# EAGLE schematic MKRNB1500_V3.0 (EAGLE 9.3.0)

## Sheet 1 of 2
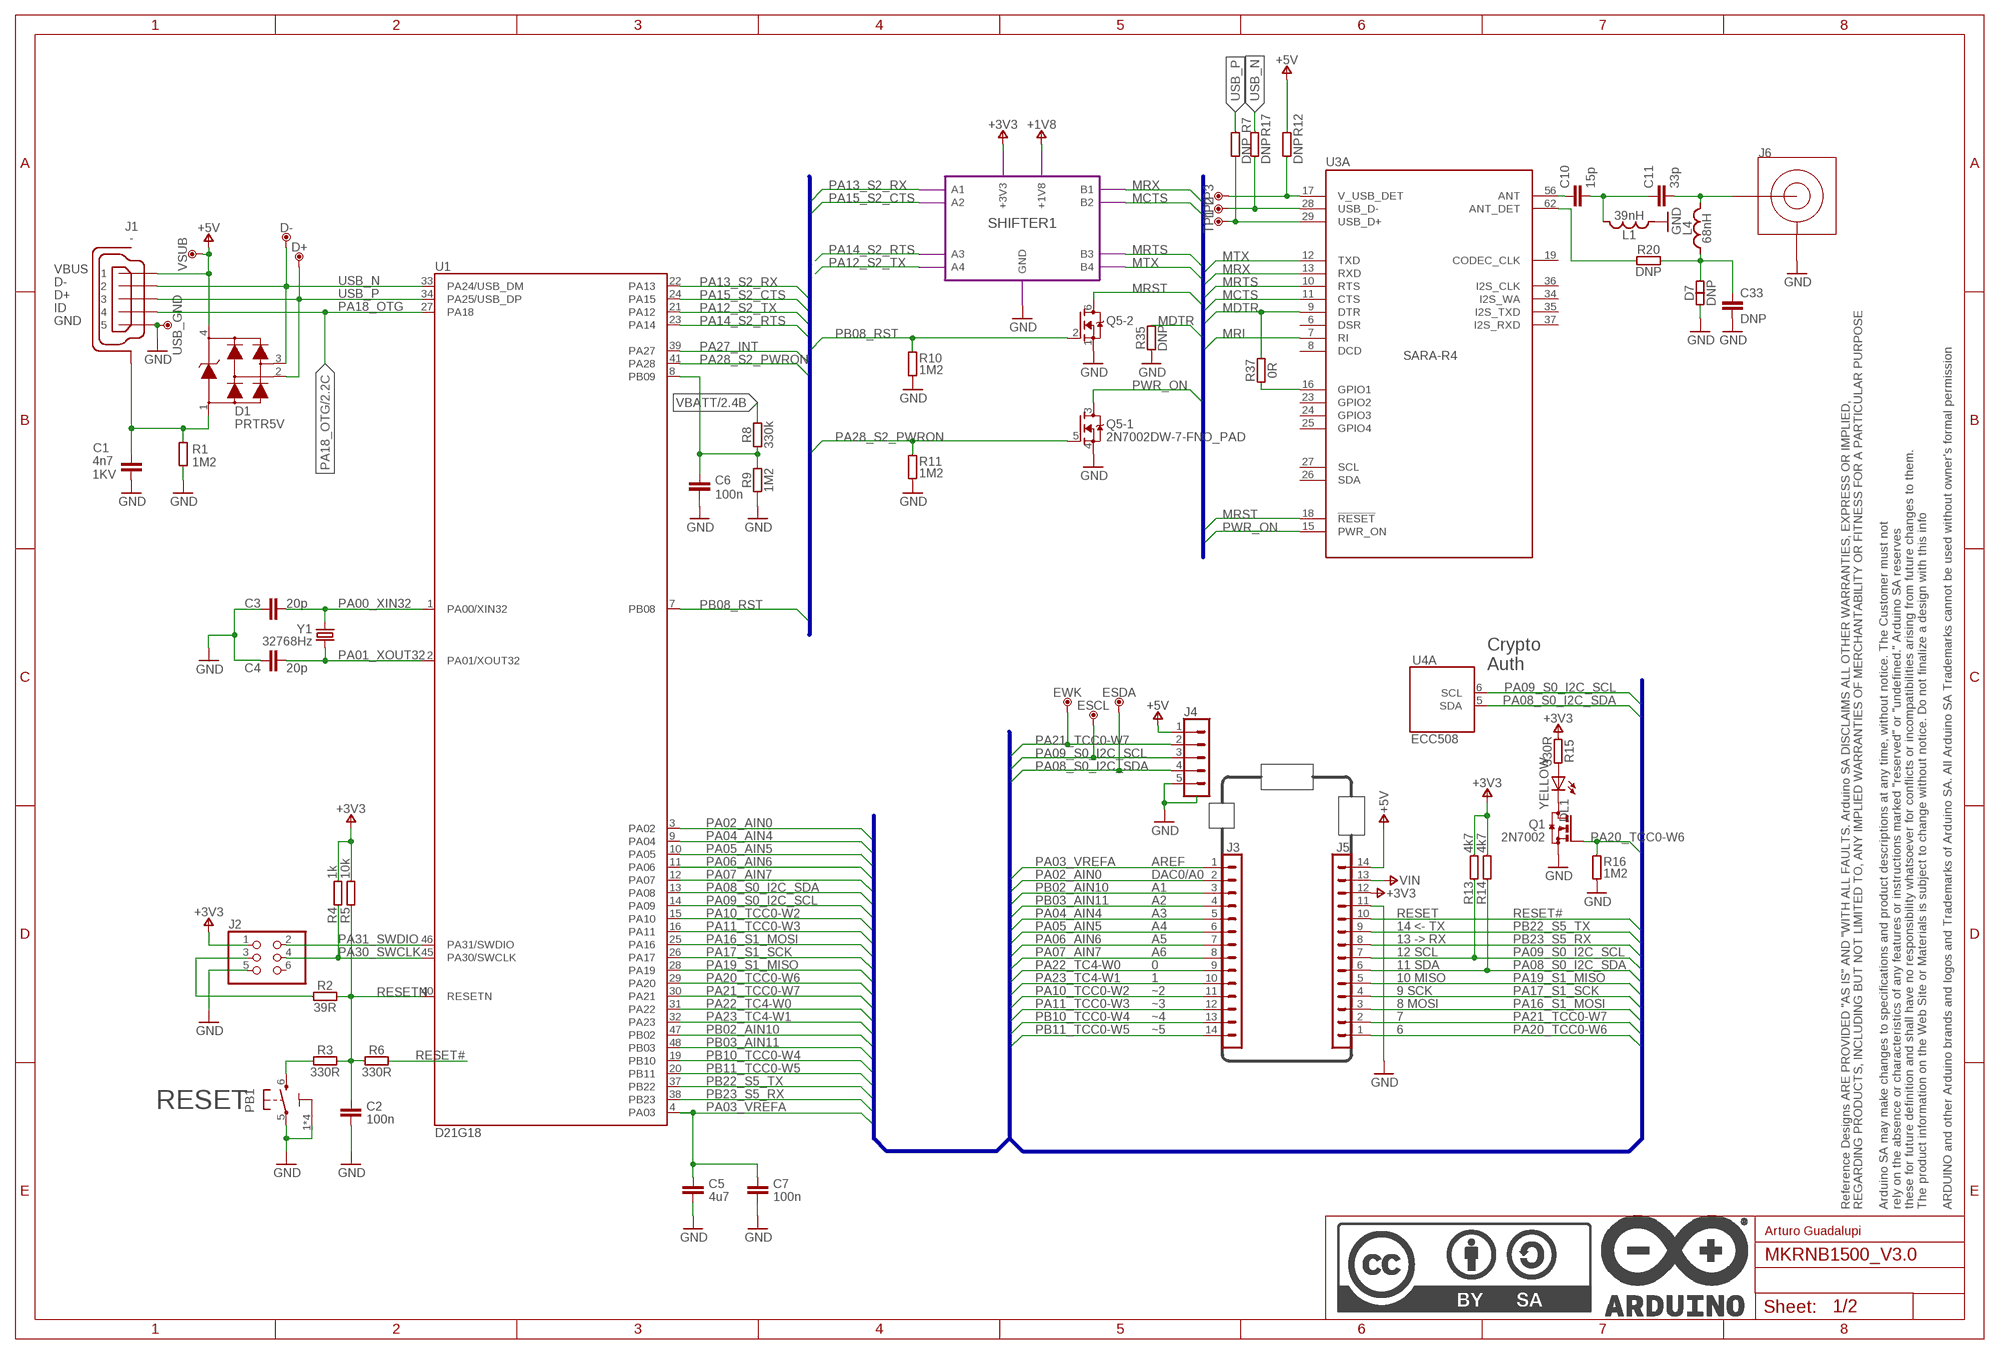
[diagram p0: schematic, sheet 1]

### Parts
C1  4n7  C4.7NF-0805  [0805-R2013X50N]
C2  100n  C-100NF-0402  [0402-1005X55N]
C3  20p  C-20PF-0402  [0402-1005X55N]
C4  20p  C-20PF-0402  [0402-1005X55N]
C5  4u7  C-4.7UF-0402  [0402-1005X55N]
C6  100n  C-100NF-0402  [0402-1005X55N]
C7  100n  C-100NF-0402  [0402-1005X55N]
C10  15p  C-15PF-0402  [0402-1005X55N]
C11  33p  C-33PF-0402  [0402-1005X55N]
C33  DNP  CDNP-0402  [0402-1005X55N]
D1  PRTR5V  PRTR5V0U2X,215  [SOT190P230X110-4N]
D7  DNP  PESD  [0402-1005X55N]
D+  DNP  TPTP-1.00MM  [TP-1.00MM]
D-  DNP  TPTP-1.00MM  [TP-1.00MM]
DL1  YELLOW  LED-YELLOW-0603  [LEDC1608X80N-AK]
ESCL  DNP  TPTP-1.00MM  [TP-1.00MM]
ESDA  DNP  TPTP-1.00MM  [TP-1.00MM]
EWK  DNP  TPTP-1.00MM  [TP-1.00MM]
FRAME1  DNP  A3-FRAME  [FRAME]
J1  -  USB-MICRO  [ZX62-AB-5PA]
J2  DNP  PINHD-2X03-DNPSMD-NH  [2X3_SMT]
J3  -  PINHD-1X14-SM-MALE/FEMALETH-SMD  [1X14_SMD_TH]
J4  -  SM05B-SRSS-TB  [SM05B-SRSS-TB]
J5  -  PINHD-1X14-SM-MALE/FEMALETH-SMD  [1X14_SMD_TH]
J6  -  UFL  [U.FL-R-SMT-1(60)]
L1  39nH  L-39NH-0402  [C0402]
L4  68nH  L-68NH-0402  [C0402]
PB1  PTS820  TACTILE1PTS820-NH  [C&K_PTS820_NO_HOLES]
Q1  2N7002  2N7002T-SOT523  [SOTFL50P160X78-3]
Q5  2N7002DW-7-FNO_PAD  [PWR_SC70-6L2]
R1  1M2  R-1M2-0402  [0402-1005X55N]
R2  39R  R-39R-0402  [0402-1005X55N]
R3  330R  R-330R-0402  [0402-1005X55N]
R4  1k  R-1K-0402  [0402-1005X55N]
R5  10k  R-10K-0402  [0402-1005X55N]
R6  330R  R-330R-0402  [0402-1005X55N]
R7  DNP  R-DNP-0402  [0402-1005X55N]
R8  330k  R-330K-0402  [0402-1005X55N]
R9  1M2  R-1M2-0402  [0402-1005X55N]
R10  1M2  R-1M2-0402  [0402-1005X55N]
R11  1M2  R-1M2-0402  [0402-1005X55N]
R12  DNP  R-DNP-0402  [0402-1005X55N]
R13  4k7  R-4K7-0402  [0402-1005X55N]
R14  4k7  R-4K7-0402  [0402-1005X55N]
R15  330R  R-330R-0402  [0402-1005X55N]
R16  1M2  R-1M2-0402  [0402-1005X55N]
R17  DNP  R-DNP-0402  [0402-1005X55N]
R20  DNP  R-DNP-0402  [0402-1005X55N]
R35  DNP  R-DNP-0402  [0402-1005X55N]
R37  0R  R-0R-0402  [0402-1005X55N]
TP1  DNP  TPTP-1.00MM  [TP-1.00MM]
TP2  DNP  TPTP-1.00MM  [TP-1.00MM]
TP3  DNP  TPTP-1.00MM  [TP-1.00MM]
U1  D21G18  ATSAMD21G18A-48QFN  [QFN50P700X700X90-49XN-EPSQ515]
U3  SARA-R4  [SARA-96]
U4  ECC508  ATECC-5088-UDFN  [SON50P300X200X60-9N-EP160X140]
USB_GND  DNP  TPTP-1.00MM  [TP-1.00MM]
VSUB  DNP  TPTP-1.00MM  [TP-1.00MM]
Y1  32768Hz  32.768KHZ  [ABS07]

### Module instances
SHIFTER1 = SHIFTER (part numbers offset by 100)

### Nets
+1V8: port SHIFTER1.+1V8 ; also sheet 2
+3V3: J2.1 J5.12 R4.2 R5.2 R13.2 R14.2 R15.1 ; port SHIFTER1.+3V3 ; also sheet 2
+5V: D1.4 J1.1 J4.1 J5.14 R12.1 VSUB.X ; also sheet 2
GND: C1.2 C2.2 C3.1 C4.1 C5.2 C6.2 C7.2 C33.2 D7.1 J1.5 J2.5 J4.5 J4.SH1(SH) J4.SH2(SH) J5.11 J6.GND1(GND) J6.GND2(GND) L1.1 PB1.1 PB1.2 PB1.3 PB1.4 PB1.5 Q1.S Q5.1(-2:S) Q5.4(-1:S) R1.1 R9.1 R10.1 R11.1 R16.1 R35.1 USB_GND.X ; port SHIFTER1.GND ; also sheet 2
MCTS: U3.11(A:CTS) ; port SHIFTER1.B2
MDTR: R35.2 R37.2 U3.9(A:DTR)
MRI: U3.7(A:RI)
MRST: Q5.6(-2:D) U3.18(A:!RESET)
MRTS: U3.10(A:RTS) ; port SHIFTER1.B3
MRX: U3.13(A:RXD) ; port SHIFTER1.B1
MTX: U3.12(A:TXD) ; port SHIFTER1.B4
N17658775: PB1.6 R3.1
N$1: C1.1 D1.1 J1.6(SH) J1.7(SH) J1.8(SH) J1.9(SH) J1.10(SH) J1.11(SH) R1.2
N$4: J2.3 R2.1
N$5: C10.1 U3.56(A:ANT)
N$6: C6.1 R8.1 R9.2 U1.8(PB09)
N$7: DL1.A R15.2
N$8: C11.2 J6.SIG L4.2
N$9: R7.2 TP1.X U3.29(A:USB_D+)
N$10: DL1.C Q1.D
N$12: R17.2 TP2.X U3.28(A:USB_D-)
N$13: R12.2 TP3.X U3.17(A:V_USB_DET)
N$14: C10.2 C11.1 L1.2
N$20: R37.1 U3.16(A:GPIO1)
N$25: R20.1 U3.62(A:ANT_DET)
N$26: C33.1 D7.2 L4.1 R20.2
PA00_XIN32: C3.2 U1.1(PA00/XIN32) Y1.2
PA01_XOUT32: C4.2 U1.2(PA01/XOUT32) Y1.1
PA02_AIN0: J3.2 U1.3(PA02)
PA03_VREFA: C5.1 C7.1 J3.1 U1.4(PA03)
PA04_AIN4: J3.5 U1.9(PA04)
PA05_AIN5: J3.6 U1.10(PA05)
PA06_AIN6: J3.7 U1.11(PA06)
PA07_AIN7: J3.8 U1.12(PA07)
PA08_S0_I2C_SDA: ESDA.X J4.4 J5.6 R14.1 U1.13(PA08) U4.5(A:SDA) ; also sheet 2
PA09_S0_I2C_SCL: ESCL.X J4.3 J5.7 R13.1 U1.14(PA09) U4.6(A:SCL) ; also sheet 2
PA10_TCC0-W2: J3.11 U1.15(PA10)
PA11_TCC0-W3: J3.12 U1.16(PA11)
PA12_S2_TX: U1.21(PA12) ; port SHIFTER1.A4
PA13_S2_RX: U1.22(PA13) ; port SHIFTER1.A1
PA14_S2_RTS: U1.23(PA14) ; port SHIFTER1.A3
PA15_S2_CTS: U1.24(PA15) ; port SHIFTER1.A2
PA16_S1_MOSI: J5.3 U1.25(PA16)
PA17_S1_SCK: J5.4 U1.26(PA17)
PA18_OTG: J1.4 U1.27(PA18) ; also sheet 2
PA19_S1_MISO: J5.5 U1.28(PA19)
PA20_TCC0-W6: J5.1 Q1.G R16.2 U1.29(PA20)
PA21_TCC0-W7: EWK.X J4.2 J5.2 U1.30(PA21)
PA22_TC4-W0: J3.9 U1.31(PA22)
PA23_TC4-W1: J3.10 U1.32(PA23)
PA27_INT: U1.39(PA27) ; also sheet 2
PA28_S2_PWRON: Q5.5(-1:G) R11.2 U1.41(PA28)
PA30_SWCLK: J2.4 R4.1 U1.45(PA30/SWCLK)
PA31_SWDIO: J2.2 U1.46(PA31/SWDIO)
PB02_AIN10: J3.3 U1.47(PB02)
PB03_AIN11: J3.4 U1.48(PB03)
PB08_RST: Q5.2(-2:G) R10.2 U1.7(PB08)
PB10_TCC0-W4: J3.13 U1.19(PB10)
PB11_TCC0-W5: J3.14 U1.20(PB11)
PB22_S5_TX: J5.9 U1.37(PB22)
PB23_S5_RX: J5.8 U1.38(PB23)
PWR_ON: Q5.3(-1:D) U3.15(A:PWR_ON)
RESET#: J5.10 R6.2
RESETN: C2.1 R2.2 R3.2 R5.1 R6.1 U1.40(RESETN)
USB_N [usb]: D1.3 D-.X J1.2 R17.1 U1.33(PA24/USB_DM)
USB_P [usb]: D1.2 D+.X J1.3 R7.1 U1.34(PA25/USB_DP)
VBATT: R8.2 ; also sheet 2
VIN: J5.13 ; also sheet 2
Unconnected: J2.6 U3.6(A:DSR) U3.8(A:DCD) U3.19(A:CODEC_CLK) U3.23(A:GPIO2) U3.24(A:GPIO3) U3.25(A:GPIO4) U3.26(A:SDA) U3.27(A:SCL) U3.34(A:I2S_WA) U3.35(A:I2S_TXD) U3.36(A:I2S_CLK) U3.37(A:I2S_RXD)

### Buses
PA03_VREFA,PA02_AIN0,PB02_AIN10,PB03_AIN11,PA04_AIN4,PA05_AIN5,PA06_AIN6,PA07_AIN7,PA22_TC4-W0,PA23_TC4-W1,PA10_TCC0-W2,PA11_TCC0-W3,PB10_TCC0-W4,PB11_TCC0-W5,PA20_TCC0-W6,PA21_TCC0-W7,PA16_S1_MOSI,PA17_S1_SCK,PA19_S1_MISO,PA08_S0_I2C_SDA,PA09_S0_I2C_SCL,PB23_S5_RX,PB22_S5_TX,RESET#
MDTR,MI2SCLK,MRI
PA27_INT

### Notes on the sheet
- Crypto
  Auth
- AREF
- DAC0/A0
- A1
- A2
- A3 | RESET
- A4 | 14 <- TX
- A5 | 13 -> RX
- A6 | 12 SCL
- 0 | 11 SDA
- 1 | 10 MISO
- ~2 | 9 SCK
- ~3 | 8 MOSI
- ~4 | 7
- ~5 | 6
- RESET
- Arturo Guadalupi

## Sheet 2 of 2
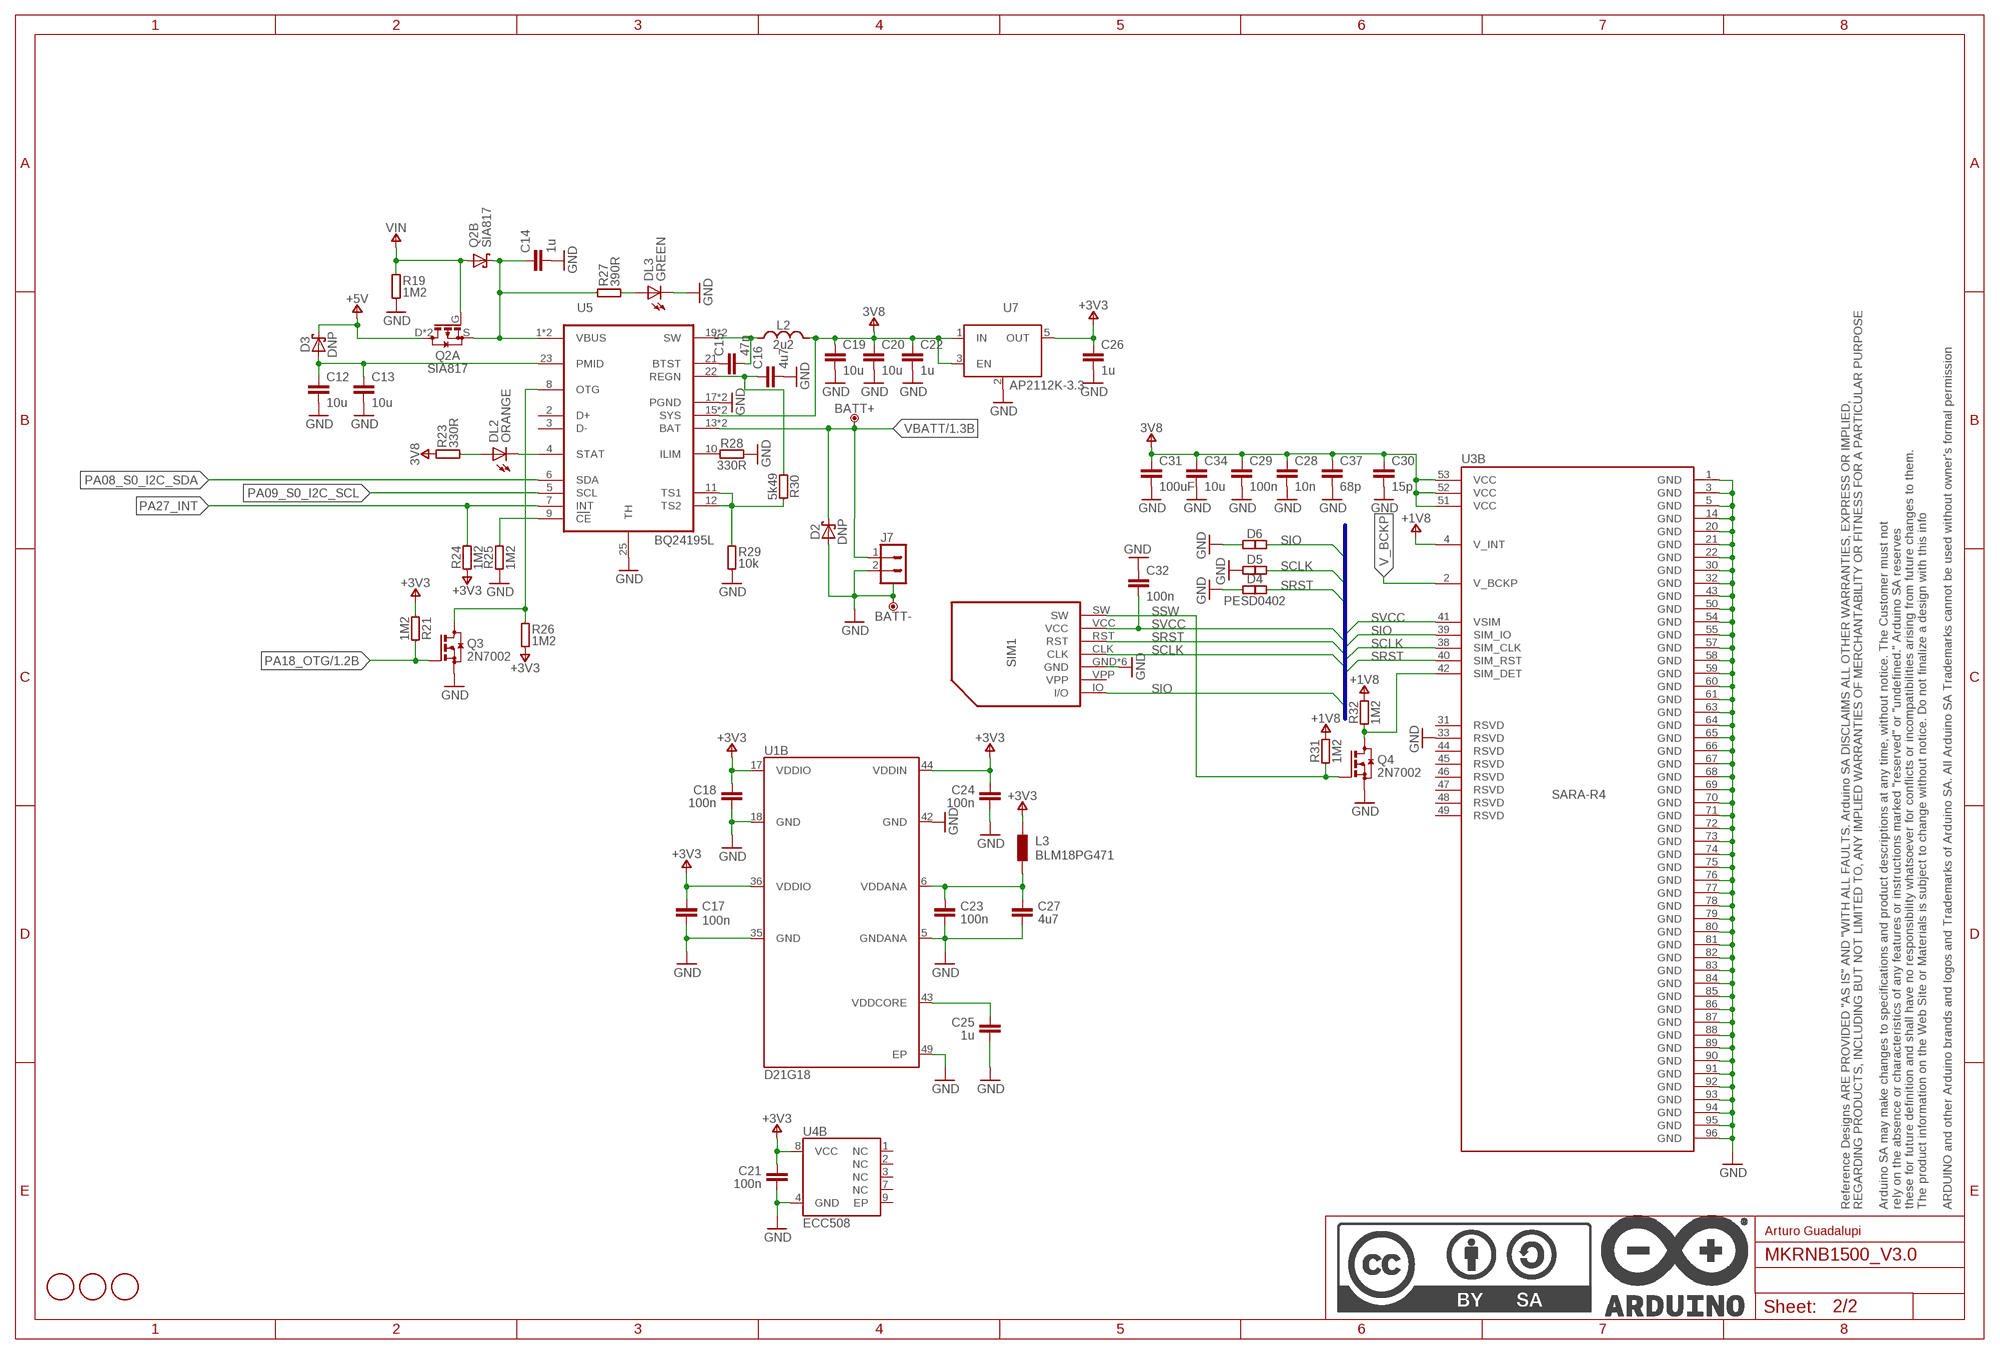
[diagram p1: schematic, sheet 2]

### Parts
BATT+  DNP  TPTP-1.00MM  [TP-1.00MM]
BATT-  DNP  TPTP-1.00MM  [TP-1.00MM]
C12  10u  C-10UF-0603  [0603-1608X90N]
C13  10u  C-10UF-0603  [0603-1608X90N]
C14  1u  C-1UF-0402  [0402-1005X55N]
C15  47n  C-47N-0402  [0402-1005X55N]
C16  4u7  C-4.7UF-0402  [0402-1005X55N]
C17  100n  C-100NF-0402  [0402-1005X55N]
C18  100n  C-100NF-0402  [0402-1005X55N]
C19  10u  C-10UF-0603  [0603-1608X90N]
C20  10u  C-10UF-0603  [0603-1608X90N]
C21  100n  C-100NF-0402  [0402-1005X55N]
C22  1u  C-1UF-0402  [0402-1005X55N]
C23  100n  C-100NF-0402  [0402-1005X55N]
C24  100n  C-100NF-0402  [0402-1005X55N]
C25  1u  C-1UF-0402  [0402-1005X55N]
C26  1u  C-1UF-0402  [0402-1005X55N]
C27  4u7  C-4.7UF-0603  [0603-1608X90N]
C28  10n  C-10NF-0402  [0402-1005X55N]
C29  100n  C-100NF-0402  [0402-1005X55N]
C30  15p  C-15PF-0402  [0402-1005X55N]
C31  100uF  C-100UF-1206  [C1206]
C32  100n  C-100NF-0402  [0402-1005X55N]
C34  10u  C-10UF-0603  [0603-1608X90N]
C37  68p  C-68PF-0402  [0402-1005X55N]
D2  DNP  PMEG6020AELRX-DNP  [SODFL3517X110N]
D3  DNP  PMEG6020AELRX-DNP  [SODFL3517X110N]
D4  PESD0402  PESD  [0402-1005X55N]
D5  PESD0402  PESD  [0402-1005X55N]
D6  PESD0402  PESD  [0402-1005X55N]
DL2  ORANGE  LED-ORANGE-0603  [LEDC1608X80N-AK]
DL3  GREEN  LED-GREEN-0603  [LEDC1608X80N-AK]
FD1  DNP  FIDUCIAL-1.5MM  [FD-1-1.5]
FD2  DNP  FIDUCIAL-1.5MM  [FD-1-1.5]
FD3  DNP  FIDUCIAL-1.5MM  [FD-1-1.5]
FRAME2  DNP  A3-FRAME  [FRAME]
J7  -  BATTERY  [JST-S2B-PH-SM4-TB]
L2  2u2  LSRP  [SRP4020]
L3  BLM18PG471  FERRITE-470R0603  [0603-1608X90N]
Q2  SIA817  SIA817EDJ  [SON65P205X205X75-8N-MWSD]
Q3  2N7002  2N7002T-SOT523  [SOTFL50P160X78-3]
Q4  2N7002  2N7002T-SOT523  [SOTFL50P160X78-3]
R19  1M2  R-1M2-0402  [0402-1005X55N]
R21  1M2  R-1M2-0402  [0402-1005X55N]
R23  330R  R-330R-0402  [0402-1005X55N]
R24  1M2  R-1M2-0402  [0402-1005X55N]
R25  1M2  R-1M2-0402  [0402-1005X55N]
R26  1M2  R-1M2-0402  [0402-1005X55N]
R27  390R  R-390R-0402  [0402-1005X55N]
R28  330R  R-330R-0402  [0402-1005X55N]
R29  10k  R-10K-0402  [0402-1005X55N]
R30  5k49  R-5K49-0402  [0402-1005X55N]
R31  1M2  R-1M2-0402  [0402-1005X55N]
R32  1M2  R-1M2-0402  [0402-1005X55N]
SIM1  -  SIM  [MICROSIM8]
U5  BQ24195L  BQ24195QFN-24  [QFN24]
U7  AP2112K-3.3  [SOT25]

### Nets
+1V8: R31.2 R32.2 U3.4(B:V_INT) ; also sheet 1
+3V3: C17.1 C18.1 C21.1 C24.1 C26.1 L3.1 R21.1 R24.1 R26.1 U1.17(VDDIO) U1.36(VDDIO) U1.44(VDDIN) U4.8(B:VCC) U7.5(OUT) ; also sheet 1
+3V8: C19.1 C20.1 C22.1 C28.1 C29.1 C30.1 C31.1 C34.1 C37.1 L2.2 R23.2 U3.51(B:VCC) U3.52(B:VCC) U3.53(B:VCC) U5.15(SYS) U5.16(SYS) U7.1(IN) U7.3(EN) ; supply symbol labelled 3V8
+5V: D3.C Q2.D2(A:D) Q2.D(A:D) ; also sheet 1
GND: BATT-.X C12.2 C13.2 C14.2 C16.2 C17.2 C18.2 C19.2 C20.2 C21.2 C22.2 C23.2 C24.2 C25.2 C26.2 C27.2 C28.2 C29.2 C30.2 C31.2 C32.1 C34.2 C37.2 D2.A D4.1 D5.1 D6.1 DL3.C J7.2 J7.3(SH) J7.4(SH) Q3.S Q4.S R19.1 R25.1 R28.2 R29.1 SIM1.GND SIM1.SH1(GND) SIM1.SH2(GND) SIM1.SH3(GND) SIM1.SH4(GND) SIM1.SH5(GND) U1.5(GNDANA) U1.18(GND) U1.35(GND) U1.42(GND) U1.49(EP) U3.1(B:GND) U3.3(B:GND) U3.5(B:GND) U3.14(B:GND) U3.20(B:GND) U3.21(B:GND) U3.22(B:GND) U3.30(B:GND) U3.32(B:GND) U3.33(B:RSVD) U3.43(B:GND) U3.50(B:GND) U3.54(B:GND) U3.55(B:GND) U3.57(B:GND) U3.58(B:GND) U3.59(B:GND) U3.60(B:GND) U3.61(B:GND) U3.63(B:GND) U3.64(B:GND) U3.65(B:GND) U3.66(B:GND) U3.67(B:GND) U3.68(B:GND) U3.69(B:GND) U3.70(B:GND) U3.71(B:GND) U3.72(B:GND) U3.73(B:GND) U3.74(B:GND) U3.75(B:GND) U3.76(B:GND) U3.77(B:GND) U3.78(B:GND) U3.79(B:GND) U3.80(B:GND) U3.81(B:GND) U3.82(B:GND) U3.83(B:GND) U3.84(B:GND) U3.85(B:GND) U3.86(B:GND) U3.87(B:GND) U3.88(B:GND) U3.89(B:GND) U3.90(B:GND) U3.91(B:GND) U3.92(B:GND) U3.93(B:GND) U3.94(B:GND) U3.95(B:GND) U3.96(B:GND) U4.4(B:GND) U5.17(PGND) U5.18(PGND) U5.25(TH) U7.2(GND/ADJ) ; also sheet 1
N17798864: DL2.A R23.1
N17834267: DL3.A R27.1
N17852357: C23.1 C27.1 L3.2 U1.6(VDDANA)
N17852431: C25.1 U1.43(VDDCORE)
N$11: Q4.D R32.1 U3.42(B:SIM_DET)
N$15: C15.2 L2.1 U5.19(SW) U5.20(SW)
N$17: C14.1 Q2.K2(B:C) Q2.K(B:C) Q2.S(A:S) R27.2 U5.1(VBUS) U5.24(VBUS)
N$18: C15.1 U5.21(BTST)
N$19: R28.1 U5.10(ILIM)
N$21: C16.1 R30.1 U5.22(REGN)
N$22: Q3.D R26.2 U5.8(OTG)
N$23: R29.2 R30.2 U5.11(TS1) U5.12(TS2)
N$24: R25.2 U5.9(CE)
PA08_S0_I2C_SDA: U5.6(SDA) ; also sheet 1
PA09_S0_I2C_SCL: U5.5(SCL) ; also sheet 1
PA18_OTG: Q3.G R21.2 ; also sheet 1
PA27_INT: R24.2 U5.7(INT) ; also sheet 1
SCLK: D5.2 SIM1.CLK U3.38(B:SIM_CLK)
SIO: D6.2 SIM1.IO(I/O) U3.39(B:SIM_IO)
SRST: D4.2 SIM1.RST U3.40(B:SIM_RST)
SSW: Q4.G R31.1 SIM1.SW
STAT: DL2.C U5.4(STAT)
SVCC: C32.2 SIM1.VCC U3.41(B:VSIM)
V_BCKP: U3.2(B:V_BCKP)
VBATT: BATT+.X D2.C J7.1 U5.13(BAT) U5.14(BAT) ; also sheet 1
VIN: Q2.A(B:A) Q2.G(A:G) R19.2 ; also sheet 1
VUSB1: C12.1 C13.1 D3.A U5.23(PMID)
Unconnected: SIM1.VPP U3.31(B:RSVD) U3.44(B:RSVD) U3.45(B:RSVD) U3.46(B:RSVD) U3.47(B:RSVD) U3.48(B:RSVD) U3.49(B:RSVD) U4.1(B:NC) U4.2(B:NC) U4.3(B:NC) U4.7(B:NC) U4.9(B:EP) U5.2(D+) U5.3(D-)

### Buses
B$1

### Notes on the sheet
- Arturo Guadalupi

## Library data of the parts
BATT+ BATT- D+ D- ESCL ESDA EWK TP1-TP3 USB_GND VSUB = Arduino-utility:TP: Testpoint; CODE-ARDUINO: DNP; DATASHEET: DNP; DISTRIBUTOR-LINK: DNP; DISTRIBUTOR-PN: DNP; MANUFACTURER: DNP; MANUFACTURER-PN: DNP
C1 = Arduino-rcl:C: SMD Capacitor; CODE-ARDUINO: 0689; DATASHEET: http://www.kemet.com/Lists/ProductCatalog/Attachments/40/KEM_C1010_X7R_HV_SMD.pdf; DISTRIBUTOR-LINK: www.kemet.com/docfinder?Partnumber=C0805C472KDRACTU; DISTRIBUTOR-PN: 399-6738-1-ND; MANUFACTURER: Kemet; MANUFACTURER-PN: C0805C472KDRACTU; NOTE: -; VOLTAGE: 1KV
C2 C6 C7 C17 C18 C21 C23 C24 C29 C32 = Arduino-rcl:C: SMD Capacitor; CODE-ARDUINO: 0132; DATASHEET: http://www.tdk.com/pdf/TDKMLCCCapRange.pdf; DISTRIBUTOR-LINK: http://www.digikey.com/product-detail/en/tdk-corporation/C1005X5R1H104K050BB/445-5942-1-ND/2443982; DISTRIBUTOR-PN: 445-5942-1-ND; MANUFACTURER: TDK; MANUFACTURER-PN: C1005X5R1H104K050BB; NOTE: -
C3 C4 = Arduino-rcl:C: SMD Capacitor; CODE-ARDUINO: 2188; DATASHEET: http://www.kemet.com/docfinder?Partnumber=CBR04C200J5GAC; DISTRIBUTOR-LINK: http://www.digikey.com/product-detail/en/kemet/CBR04C200J5GAC/399-6173-1-ND/2732143; DISTRIBUTOR-PN: 399-6173-1-ND; MANUFACTURER: Kemet; MANUFACTURER-PN: CBR04C200J5GAC; NOTE: -
C5 C16 = Arduino-rcl:C: SMD Capacitor; CODE-ARDUINO: 0833; DATASHEET: http://search.murata.co.jp/Ceramy/image/img/A01X/partnumbering_e_01.pdf; DISTRIBUTOR-LINK: http://www.digikey.com/product-detail/en/murata-electronics-north-america/GRM155R60J475ME47D/490-5915-1-ND/3719860; DISTRIBUTOR-PN: 490-5915-1-ND; MANUFACTURER: Murata; MANUFACTURER-PN: GRM155R60J475ME47D; NOTE: -
C10 C30 = Arduino-rcl:C: SMD Capacitor; CODE-ARDUINO: -; DATASHEET: http://search.murata.co.jp/Ceramy/image/img/A01X/partnumbering_e_01.pdf; DISTRIBUTOR-LINK: https://www.digikey.com/product-detail/en/murata-electronics-north-america/GRM1555C1H150JA01D/490-5888-1-ND/3315234; DISTRIBUTOR-PN: 490-5888-1-ND; MANUFACTURER: Murata; MANUFACTURER-PN: GRM1555C1H150JA01D; NOTE: -
C11 = Arduino-rcl:C: SMD Capacitor; CODE-ARDUINO: -; DATASHEET: http://www.murata.com/~/media/webrenewal/support/library/catalog/products/capacitor/mlcc/c02e.pdf; DISTRIBUTOR-LINK: http://www.digikey.com/product-search/en?keywords=490-5936-1-ND; DISTRIBUTOR-PN: 490-5936-1-ND; MANUFACTURER: Murata; MANUFACTURER-PN: GRM1555C1H330JA01D; NOTE: -
C12 C13 C19 C20 C34 = Arduino-rcl:C: SMD Capacitor; CODE-ARDUINO: 2213; DATASHEET: http://www.murata.com/~/media/webrenewal/support/library/catalog/products/capacitor/mlcc/c02e.pdf; DISTRIBUTOR-LINK: http://www.digikey.com/product-search/en?keywords=490-10728-1-ND; DISTRIBUTOR-PN: 490-10728-1-ND; MANUFACTURER: Murata; MANUFACTURER-PN: GRM188R61C106KAALD; NOTE: -
C14 C22 C25 C26 = Arduino-rcl:C: SMD Capacitor; CODE-ARDUINO: 0133; DATASHEET: http://search.murata.co.jp/Ceramy/image/img/A01X/partnumbering_e_01.pdf; DISTRIBUTOR-LINK: http://www.digikey.com/product-detail/en/murata-electronics-north-america/GRM155R61E105KA12D/490-10017-1-ND/5026367; DISTRIBUTOR-PN: 490-10017-1-ND; MANUFACTURER: Murata; MANUFACTURER-PN: GRM155R61E105KA12D; NOTE: -
C15 = Arduino-rcl:C: SMD Capacitor; CODE-ARDUINO: 2216; DATASHEET: http://www.murata.com/~/media/webrenewal/support/library/catalog/products/capacitor/mlcc/c02e.pdf; DISTRIBUTOR-LINK: https://www.digikey.com/product-detail/en/murata-electronics-north-america/GRM155R71E473KA88D/490-3254-1-ND/702795; DISTRIBUTOR-PN: 490-3254-1-ND; MANUFACTURER: Murata; MANUFACTURER-PN: GRM155R71E473KA88D; NOTE: -
C27 = Arduino-rcl:C: SMD Capacitor; CODE-ARDUINO: 0458; DATASHEET: http://www.murata.com/~/media/webrenewal/support/library/catalog/products/capacitor/mlcc/c02e.pdf; DISTRIBUTOR-LINK: http://www.digikey.com/product-search/en?keywords=490-7203-1-ND; DISTRIBUTOR-PN: 490-7203-1-ND; MANUFACTURER: Murata; MANUFACTURER-PN: GRM188R61E475KE11D; NOTE: -
C28 = Arduino-rcl:C: SMD Capacitor; CODE-ARDUINO: 0165; DATASHEET: http://search.murata.co.jp/Ceramy/image/img/A01X/partnumbering_e_01.pdf; DISTRIBUTOR-LINK: http://www.digikey.com/product-detail/en/murata-electronics-north-america/GRM155R71H103KA88J/490-6351-1-ND/3845548; DISTRIBUTOR-PN: 490-6351-1-ND; MANUFACTURER: Murata; MANUFACTURER-PN: GRM155R71H103KA88J; NOTE: -
C31 = Arduino-rcl:C: SMD Capacitor; CODE-ARDUINO: -; DATASHEET: http://search.murata.co.jp/Ceramy/image/img/A01X/partnumbering_e_01.pdf; DISTRIBUTOR-LINK: https://www.digikey.com/product-detail/en/murata-electronics-north-america/GRM31CD80J107ME39L/490-10525-1-ND/5026461; DISTRIBUTOR-PN: 490-10525-1-ND; MANUFACTURER: Murata; MANUFACTURER-PN: GRM31CD80J107ME39L; NOTE: -
C33 = Arduino-rcl:C: SMD Capacitor; CODE-ARDUINO: DNP; DATASHEET: DNP; DISTRIBUTOR-LINK: DNP; DISTRIBUTOR-PN: DNP; MANUFACTURER: DNP; MANUFACTURER-PN: DNP; NOTE: DNP
C37 = Arduino-rcl:C: SMD Capacitor; CODE-ARDUINO: -; DATASHEET: http://search.murata.co.jp/Ceramy/image/img/A01X/partnumbering_e_01.pdf; DISTRIBUTOR-LINK: https://www.digikey.com/product-detail/en/murata-electronics-north-america/GRM1555C2A680JA01D/490-7309-1-ND/4213238; DISTRIBUTOR-PN: 490-7309-1-ND; MANUFACTURER: Murata; MANUFACTURER-PN: GRM1555C2A680JA01D; NOTE: -
D1 = Arduino-diodes:PRTR5V0U2X,215: USB ESD protection; CODE-ARDUINO: 2209; DATASHEET: http://www.nxp.com/documents/data_sheet/PRTR5V0U2X.pdf; DISTRIBUTOR-LINK: http://www.digikey.com/product-detail/en/nxp-semiconductors/PRTR5V0U2X,215/568-4140-1-ND/1589981; DISTRIBUTOR-PN: 568-4140-1-ND; MANUFACTURER: NXP; MANUFACTURER-PN: PRTR5V0U2X,215
D2 D3 = Arduino-diodes:PMEG6020AELRX: 60 V, 2 A low leakage current Schottky barrier rectifier Datasheet <http://www.nxp.com/documents/data_sheet/PMEG6020AELR.pdf>; CODE-ARDUINO: DNP; DATASHEET: DNP; DISTRIBUTOR-LINK: DNP; DISTRIBUTOR-PN: DNP; MANUFACTURER: DNP; MANUFACTURER-PN: DNP
D4-D6 = Arduino-diodes:PESD: ESD protection; CODE-ARDUINO: 2280; DATASHEET: http://www.littelfuse.com/~/media/electronics/product_specifications/polymer_esd_suppressors/littelfuse_polymer_esd_suppressor_pesd0402_140_product_specification.pdf.pdf; DISTRIBUTOR-LINK: https://www.digikey.com/product-detail/en/littelfuse-inc/PESD0402-140/PESD0402-140CT-ND/1968526; DISTRIBUTOR-PN: PESD0402-140CT-ND; MANUFACTURER: Littlefuse; MANUFACTURER-PN: PESD0402-140
D7 = Arduino-diodes:PESD: ESD protection; CODE-ARDUINO: 2280; DATASHEET: http://www.littelfuse.com/~/media/electronics/product_specifications/polymer_esd_suppressors/littelfuse_polymer_esd_suppressor_pesd0402_140_product_specification.pdf.pdf; DISTRIBUTOR-LINK: https://www.digikey.com/product-detail/en/littelfuse-inc/PESD0402-140/PESD0402-140CT-ND/1968526; DISTRIBUTOR-PN: PESD0402-140CT-ND; MANUFACTURER: Littlefuse; MANUFACTURER-PN: PESD0402-140; VALUE: PESD0402
DL1 = Arduino-diodes:LED: LED; CODE-ARDUINO: 2243; DATASHEET: http://media.digikey.com/pdf/Data%20Sheets/Avago%20PDFs/HSMz-Czzz.pdf; DISTRIBUTOR-LINK: http://www.digikey.com/product-detail/en/broadcom-limited/HSMY-C190/516-1424-1-ND/637748; DISTRIBUTOR-PN: 516-1424-1-ND; MANUFACTURER: Avago; MANUFACTURER-PN: HSMY-C190
DL2 = Arduino-diodes:LED: LED; CODE-ARDUINO: 2207; DATASHEET: http://media.digikey.com/pdf/Data%20Sheets/Avago%20PDFs/HSMz-Czzz.pdf; DISTRIBUTOR-LINK: http://www.digikey.com/product-detail/en/broadcom-limited/HSMD-C190/516-2489-1-ND/2744915; DISTRIBUTOR-PN: 516-2489-1-ND; MANUFACTURER: Avago; MANUFACTURER-PN: HSMD-C190
DL3 = Arduino-diodes:LED: LED; CODE-ARDUINO: 2204; DATASHEET: http://media.digikey.com/pdf/Data%20Sheets/Avago%20PDFs/HSMz-Czzz.pdf; DISTRIBUTOR-LINK: http://www.digikey.com/product-detail/en/broadcom-limited/HSMG-C190/516-1425-1-ND/637749; DISTRIBUTOR-PN: 516-1425-1-ND; MANUFACTURER: Avago; MANUFACTURER-PN: HSMG-C190
FD1-FD3 = Arduino-utility:FIDUCIAL: Fiducial mount; CODE-ARDUINO: DNP; DATASHEET: DNP; DISTRIBUTOR-LINK: DNP; DISTRIBUTOR-PN: DNP; MANUFACTURER: DNP; MANUFACTURER-PN: DNP
FRAME1 FRAME2 = Arduino-utility:A3-FRAME; CODE-ARDUINO: DNP; DATASHEET: DNP; DISTRIBUTOR-LINK: DNP; DISTRIBUTOR-PN: DNP; MANUFACTURER: DNP; MANUFACTURER-PN: DNP; NOTE: DNP
J1 = Arduino-connectors:USB-MICRO: USB - micro AB USB 2.0 Receptacle Connector 5 Position Surface Mount, Right Angle, Horizontal; CODE-ARDUINO: 2219; DATASHEET: https://www.hirose.com/product/en/download_file/key_name/ZX/category/Catalog/doc_file_id/31704/?file_category_id=4&item_id=13&is_series=1; DISTRIBUTOR-LINK: http://www.digikey.com/product-detail/en/hirose-electric-co-ltd/ZX62-AB-5PA(31)/H125279CT-ND/5994741; DISTRIBUTOR-PN: H125279CT-ND; MANUFACTURER: Hirose; MANUFACTURER-PN: ZX62-AB-5PA(31)
J2 = Arduino-connectors:PINHD-2X03: PIN HEADER; CODE-ARDUINO: DNP; DATASHEET: DNP; DISTRIBUTOR-LINK: DNP; DISTRIBUTOR-PN: DNP; MANUFACTURER: DNP; MANUFACTURER-PN: DNP
J3 J5 = Arduino-connectors:PINHD-1X14-SM: PIN HEADER; CODE-ARDUINO: -; DATASHEET: -; DISTRIBUTOR-LINK: -; DISTRIBUTOR-PN: -; MANUFACTURER: ELDECO; MANUFACTURER-PN: FH254114DF08500T
J4 = Arduino-connectors:SM05B-SRSS-TB: CONN HEADER SH 5POS SIDE 1MM TIN Datasheet <http://www.jst-mfg.com/product/pdf/eng/eSH.pdf>; CODE-ARDUINO: 2353; DATASHEET: http://www.jst-mfg.com/product/pdf/eng/eSH.pdf; DISTRIBUTOR-LINK: http://www.digikey.com/product-detail/en/jst-sales-america-inc/SM05B-SRSS-TB(LF)(SN)/455-1805-1-ND/926876; DISTRIBUTOR-PN: 455-1805-1-ND; MANUFACTURER: JST; MANUFACTURER-PN: SM05B-SRSS-TB
J6 = Arduino-connectors:UFL: U.FL, Ultra Miniature Coaxial Connector Receptacle, Male Pin 50 Ohm Surface Mount Solder; CODE-ARDUINO: A5364; DATASHEET: http://media.digikey.com/pdf/Data%20Sheets/Hirose%20PDFs/UFL%20Series.pdf; DISTRIBUTOR-LINK: http://www.digikey.com/product-search/en?keywords=U.FL-R-SMT-1(60); DISTRIBUTOR-PN: U.FL-R-SMT-1(60)-ND; MANUFACTURER: Hirose; MANUFACTURER-PN: U.FL-R-SMT-1(60)
J7 = Arduino-connectors:BATTERY: CONN HEADER PH SIDE 2POS 2MM SMD; CODE-ARDUINO: 2355; DATASHEET: http://www.jst-mfg.com/product/pdf/eng/ePH.pdf; DISTRIBUTOR-LINK: http://www.digikey.com/product-detail/en/jst-sales-america-inc/S2B-PH-SM4-TB%28LF%29%28SN%29/455-1749-1-ND/926846; DISTRIBUTOR-PN: 455-1749-1-ND; MANUFACTURER: JST; MANUFACTURER-PN: S2B-PH-SM4-TB(LF)(SN)
L1 = Arduino-rcl:L: Inductors; CODE-ARDUINO: -; DATASHEET: http://search.murata.co.jp/Ceramy/image/img/P02/JELF243B-0009.pdf; DISTRIBUTOR-LINK: https://www.digikey.com/product-detail/en/murata-electronics-north-america/LQG15HN39NJ02D/490-1092-1-ND/584538; DISTRIBUTOR-PN: 490-1092-1-ND; MANUFACTURER: Murata; MANUFACTURER-PN: LQG15HN39NJ02D
L2 = Arduino-rcl:L: Inductors; CODE-ARDUINO: 2218; DATASHEET: http://www.bourns.com/docs/Product-Datasheets/SRP4020TA.pdf; DISTRIBUTOR-LINK: https://www.digikey.com/product-detail/en/bourns-inc/SRP4020TA-2R2M/SRP4020TA-2R2MCT-ND/4901068; DISTRIBUTOR-PN: SRP4020TA-2R2MCT-ND; MANUFACTURER: Bourns; MANUFACTURER-PN: SRP4020TA-2R2M
L3 = Arduino-rcl:FERRITE: SMD ferrite; CODE-ARDUINO: 2217; DATASHEET: http://search.murata.co.jp/Ceramy/image/img/PDF/ENG/L0110S0100BLM18P.pdf; DISTRIBUTOR-LINK: http://www.digikey.com/product-detail/en/murata-electronics-north-america/BLM18PG471SN1D/490-5223-1-ND/1948399; DISTRIBUTOR-PN: 490-5223-1-ND; MANUFACTURER: Murata; MANUFACTURER-PN: BLM18PG471SN1D; NOTE: -
L4 = Arduino-rcl:L: Inductors; CODE-ARDUINO: -; DATASHEET: http://search.murata.co.jp/Ceramy/image/img/P02/JELF243B-0009.pdf; DISTRIBUTOR-LINK: https://www.digikey.com/product-detail/en/murata-electronics-north-america/LQG15HS68NJ02D/490-2633-1-ND/662913; DISTRIBUTOR-PN: 490-2633-1-ND; MANUFACTURER: Murata; MANUFACTURER-PN: LQG15HS68NJ02D
PB1 = Arduino-pushbuttons:TACTILE1: Tactile Switch SPST-NO Top Actuated Surface Mount; CODE-ARDUINO: 0173; DATASHEET: http://www.ckswitches.com/media/1474/pts820.pdf; DISTRIBUTOR-LINK: https://www.digikey.com/product-detail/en/c-k/PTS820-J15M-SMTR-LFS/CKN10506CT-ND/4176681; DISTRIBUTOR-PN: PTS820 J25K SMTR LFS-ND; MANUFACTURER: C&K; MANUFACTURER-PN: PTS820 J25K SMTR LFS
Q1 Q3 Q4 = Arduino-transistors:2N7002T: MOSFET N-CH 60V 115MA; CODE-ARDUINO: 2368; DATASHEET: http://www.diodes.com/_files/datasheets/ds30301.pdf; DISTRIBUTOR-LINK: http://www.digikey.com/product-detail/en/diodes-incorporated/2N7002T-7-F/2N7002T-FDICT-ND/815290; DISTRIBUTOR-PN: 2N7002T-FDICT-ND; MANUFACTURER: Diodes Incorporated; MANUFACTURER-PN: 2N7002T-7-F
Q2 = Arduino-transistors:SIA817EDJ: MOSFET P-CH 30V 4.5A SC-70-6; CODE-ARDUINO: 2220; DATASHEET: http://www.vishay.com/docs/62820/sia817edj.pdf; DISTRIBUTOR-LINK: http://www.digikey.com/product-detail/en/vishay-siliconix/SIA817EDJ-T1-GE3/SIA817EDJ-T1-GE3CT-ND/4142098; DISTRIBUTOR-PN: SIA817EDJ-T1-GE3CT-ND; MANUFACTURER: Vishay; MANUFACTURER-PN: SIA817EDJ-T1-GE3
Q5 = Arduino-transistors:2N7002DW-7-F: MOSFET 2N-CH 60V 0.23A SOT-363; DATASHEET: http://www.diodes.com/_files/datasheets/ds30120.pdf; DISTRIBUTOR-LINK: http://www.digikey.com/product-detail/en/diodes-incorporated/2N7002DW-7-F/2N7002DW-FDITR-ND/749948; DISTRIBUTOR-PN: 2N7002DW-FDITR-ND; MANUFACTURER: Diodes Incorporated; MANUFACTURER-PN: 2N7002DW-7-F
R1 R9-R11 R16 R19 R21 R24-R26 R31 R32 = Arduino-rcl:R: SMD Resistor; CODE-ARDUINO: 2352; DATASHEET: www.yageo.com.tw/exep/pages/download/literatures/PYu-R_INT-thick_7.pdf; DISTRIBUTOR-LINK: http://www.digikey.com/products/en?keywords=RC0402FR-071M2L-ND; DISTRIBUTOR-PN: RC0402FR-071M2L-ND; MANUFACTURER: Yageo; MANUFACTURER-PN: RC0402FR-071M2L; NOTE: NO
R2 = Arduino-rcl:R: SMD Resistor; CODE-ARDUINO: 0138; DATASHEET: www.yageo.com.tw/exep/pages/download/literatures/PYu-R_INT-thick_7.pdf; DISTRIBUTOR-LINK: http://www.digikey.com/product-detail/en/yageo/RC0402FR-0739RL/311-39.0LRCT-ND/729549; DISTRIBUTOR-PN: 311-39.0LRCT-ND; MANUFACTURER: Yageo; MANUFACTURER-PN: RC0402FR-0739RL; NOTE: NO
R3 R6 R15 R23 R28 = Arduino-rcl:R: SMD Resistor; CODE-ARDUINO: 2229; DATASHEET: www.yageo.com.tw/exep/pages/download/literatures/PYu-R_INT-thick_7.pdf; DISTRIBUTOR-LINK: http://www.digikey.com/product-detail/en/yageo/RC0402FR-07330RL/311-330LRCT-ND/729541; DISTRIBUTOR-PN: 311-330LRCT-ND; MANUFACTURER: Yageo; MANUFACTURER-PN: RC0402FR-07330RL; NOTE: NO
R4 = Arduino-rcl:R: SMD Resistor; CODE-ARDUINO: 0140; DATASHEET: www.yageo.com.tw/exep/pages/download/literatures/PYu-R_INT-thick_7.pdf; DISTRIBUTOR-LINK: http://www.digikey.com/product-detail/en/yageo/RC0402FR-071KL/311-1.00KLRCT-ND/729460; DISTRIBUTOR-PN: 311-1.00KLRCT-ND; MANUFACTURER: Yageo; MANUFACTURER-PN: RC0402FR-071KL; NOTE: NO
R5 R29 = Arduino-rcl:R: SMD Resistor; CODE-ARDUINO: 0136; DATASHEET: www.yageo.com.tw/exep/pages/download/literatures/PYu-R_INT-thick_7.pdf; DISTRIBUTOR-LINK: http://www.digikey.com/product-detail/en/yageo/RC0402FR-0710KL/311-10.0KLRCT-ND/729470; DISTRIBUTOR-PN: 311-10.0KLRCT-ND; MANUFACTURER: Yageo; MANUFACTURER-PN: RC0402FR-0710KL; NOTE: NO
R7 R12 R17 R20 R35 = Arduino-rcl:R: SMD Resistor; CODE-ARDUINO: DNP; DATASHEET: DNP; DISTRIBUTOR-LINK: DNP; DISTRIBUTOR-PN: DNP; MANUFACTURER: DNP; MANUFACTURER-PN: DNP; NOTE: NO
R8 = Arduino-rcl:R: SMD Resistor; CODE-ARDUINO: 2192; DATASHEET: www.yageo.com.tw/exep/pages/download/literatures/PYu-R_INT-thick_7.pdf; DISTRIBUTOR-LINK: http://www.digikey.com/product-detail/en/yageo/RC0402JR-07330KL/311-330KJRCT-ND/729413; DISTRIBUTOR-PN: 311-330KJRCT-ND; MANUFACTURER: Yageo; MANUFACTURER-PN: RC0402JR-07330KL; NOTE: NO
R13 R14 = Arduino-rcl:R: SMD Resistor; CODE-ARDUINO: 2196; DATASHEET: www.yageo.com.tw/exep/pages/download/literatures/PYu-R_INT-thick_7.pdf; DISTRIBUTOR-LINK: http://www.digikey.com/product-detail/en/yageo/RC0402FR-074K7L/311-4.7KLRCT-ND/2827881; DISTRIBUTOR-PN: 311-4.7KLRCT-ND; MANUFACTURER: Yageo; MANUFACTURER-PN: RC0402FR-074K7L; NOTE: NO
R27 = Arduino-rcl:R: SMD Resistor; CODE-ARDUINO: 2195; DATASHEET: www.yageo.com.tw/exep/pages/download/literatures/PYu-R_INT-thick_7.pdf; DISTRIBUTOR-LINK: https://www.digikey.com/product-detail/en/yageo/RC0402FR-07390RL/311-390LRCT-ND/2827929; DISTRIBUTOR-PN: 311-390LRCT-ND; MANUFACTURER: Yageo; MANUFACTURER-PN: RC0402FR-07390RL; NOTE: NO
R30 = Arduino-rcl:R: SMD Resistor; CODE-ARDUINO: 2197; DATASHEET: www.yageo.com.tw/exep/pages/download/literatures/PYu-R_INT-thick_7.pdf; DISTRIBUTOR-LINK: https://www.digikey.com/product-detail/en/yageo/RC0402FR-075K49L/311-5.49KLRCT-ND/729573; DISTRIBUTOR-PN: 311-5.49KLRCT-ND; MANUFACTURER: Yageo; MANUFACTURER-PN: RC0402FR-075K49L; NOTE: NO
R37 = Arduino-rcl:R: SMD Resistor; CODE-ARDUINO: 0039; DATASHEET: www.yageo.com.tw/exep/pages/download/literatures/PYu-R_INT-thick_7.pdf; DISTRIBUTOR-LINK: http://www.digikey.com/product-detail/en/yageo/RC0402FR-070RL/311-0.0LRCT-ND/2827888; DISTRIBUTOR-PN: 311-0.0LRCT-ND; MANUFACTURER: Yageo; MANUFACTURER-PN: RC0402FR-070RL; NOTE: NO
SIM1 = Arduino-connectors:SIM: SIM connector; CODE-BCE: -; CODE-TK2: -; DATASHEET: http://www.te.com/commerce/DocumentDelivery/DDEController?Action=srchrtrv&DocNm=2199337&DocType=Customer+Drawing&DocLang=English; DISTRIBUTOR-LINK: https://www.digikey.com/product-detail/en/te-connectivity-amp-connectors/2199337-5/A125065CT-ND/6810766; DISTRIBUTOR-PN: A125065CT-ND; MANUFACTURER: TE; MANUFACTURER-PN: 2199337-5
U1 = Arduino-ucs&SoCs:ATSAMD21G18A-48: ARM® Cortex®-M0+ SAM D21G Microcontroller IC 32-Bit 48MHz 256KB (256K x 8) FLASH 48-TQFP (7x7); CODE-ARDUINO: 2202; DATASHEET: http://www.atmel.com/Images/Atmel-42181-SAM-D21_Datasheet.pdf; DISTRIBUTOR-LINK: https://www.digikey.com/product-detail/en/microchip-technology/ATSAMD21G18A-MU/ATSAMD21G18A-MU-ND/4935894; DISTRIBUTOR-PN: ATSAMD21G18A-MU-ND; MANUFACTURER: Atmel; MANUFACTURER-PN: ATSAMD21G18A-MU
U3 = Arduino-ucs&SoCs:SARA-R4: SARA-U2: 3.75G HSPA Cellular Module u-blox.com; DATASHEET: https://www.u-blox.com/sites/default/files/SARA-R4_DataSheet_%28UBX-16024152%29.pdf; DISTRIBUTOR-LINK: https://www.digikey.com/product-detail/en/u-blox-america-inc/SARA-R410M-01B/672-1076-1-ND/7931824; DISTRIBUTOR-PN: 672-1076-1-ND; MANUFACTURER: Ublocks; MANUFACTURER-PN: SARA-R410M-01B
U4 = Arduino-ICs:ATECC: Secure authentication and product validation device, EEPROM, I2C, 2.0 - 5.5V; CODE-ARDUINO: 2203; DATASHEET: http://www.atmel.com/Images/Atmel-8923S-CryptoAuth-ATECC508A-Datasheet-Summary.pdf; DISTRIBUTOR-LINK: http://www.digikey.com/product-detail/en/atmel/ATECC508A-MAHDA-T/ATECC508A-MAHDA-TCT-ND/5213071; DISTRIBUTOR-PN: ATECC508A-MAHDA-TCT-ND; MANUFACTURER: Microchip; MANUFACTURER-PN: ATECC508A-MAHDA-T; NOTE: NO
U5 = Arduino-ICs:BQ24195: IC CHRG MGMT LI-ION/POL; CODE-ARDUINO: 2201; DATASHEET: http://www.ti.com/lit/ds/symlink/bq24195.pdf; DISTRIBUTOR-LINK: https://www.digikey.com/product-detail/en/texas-instruments/BQ24195LRGET/296-35047-1-ND/3725759; DISTRIBUTOR-PN: 296-35047-1-ND; MANUFACTURER: Texas Instruments; MANUFACTURER-PN: BQ24195LRGET; NOTE: NO
U7 = Arduino-ICs:AP2112K-3.3: IC REG LINEAR 3.3V 600mA SOT25; CODE-ARDUINO: 2199; DATASHEET: https://www.diodes.com/assets/Datasheets/AP2112.pdf; DISTRIBUTOR-LINK: https://www.digikey.com/product-detail/en/diodes-incorporated/AP2112K-3.3TRG1/AP2112K-3.3TRG1DITR-ND/4470746; DISTRIBUTOR-PN: AP2112K-3.3TRG1DITR-ND; MANUFACTURER: Diodes Inc; MANUFACTURER-PN: AP2112K-3.3TRG1; NOTE: NO
Y1 = Arduino-crystals:32.768KHZ: LF crystal; CODE-ARDUINO: 0213; DATASHEET: http://www.abracon.com/Resonators/ABS07.pdf; DISTRIBUTOR-LINK: http://www.digikey.com/product-detail/en/abracon-llc/ABS07-32.768KHZ-T/535-9542-1-ND/1237009; DISTRIBUTOR-PN: 535-9542-1-ND; MANUFACTURER: Abracon LLC; MANUFACTURER-PN: ABS07-32.768KHZ-T

## Module SHIFTER
Ports: GND(pwr) +3V3(pwr) +1V8(pwr) A1(out) A2(out) B4(out) B3(out) B1(in) B2(in) A3(in) A4(in)
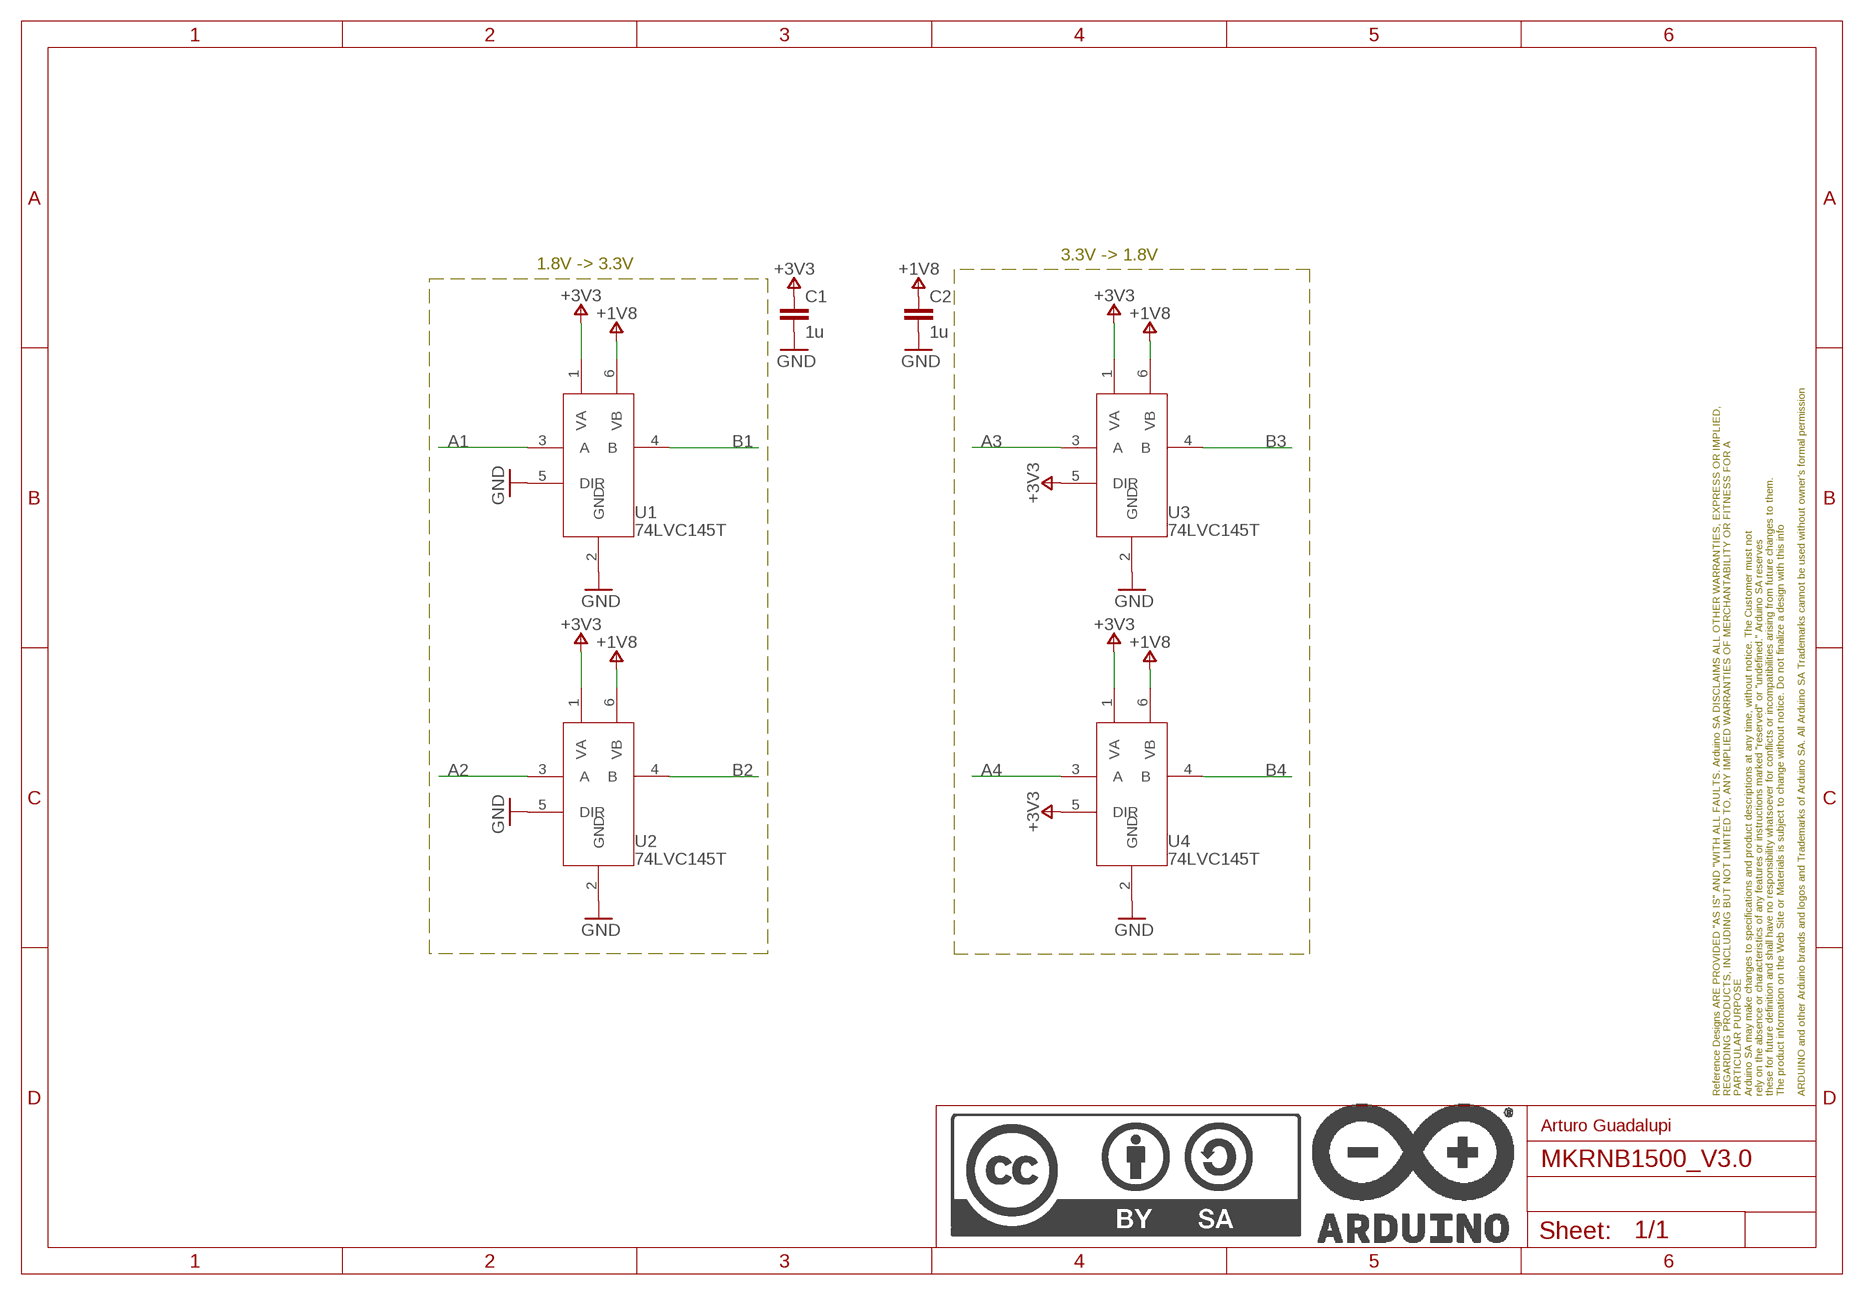
[diagram p2: schematic, module SHIFTER, sheet 1]

### Parts
C1  1u  C-1UF-0402  [0402-1005X55N]
C2  1u  C-1UF-0402  [0402-1005X55N]
FRAME1  DNP  A4L-LOC  [FRAME]
U1  74LVC145T  SN74LVC1T45  [DCK]
U2  74LVC145T  SN74LVC1T45  [DCK]
U3  74LVC145T  SN74LVC1T45  [DCK]
U4  74LVC145T  SN74LVC1T45  [DCK]

### Nets
+1V8: C2.1 U1.6(VB) U2.6(VB) U3.6(VB) U4.6(VB)
+3V3: C1.1 U1.1(VA) U2.1(VA) U3.1(VA) U3.5(DIR) U4.1(VA) U4.5(DIR)
A1: U1.3(A)
A2: U2.3(A)
A3: U3.3(A)
A4: U4.3(A)
B1: U1.4(B)
B2: U2.4(B)
B3: U3.4(B)
B4: U4.4(B)
GND: C1.2 C2.2 U1.2(GND) U1.5(DIR) U2.2(GND) U2.5(DIR) U3.2(GND) U4.2(GND)

### Notes on the sheet
- 3.3V -> 1.8V
- 1.8V -> 3.3V
- Arturo Guadalupi

### Library data of the parts
C1 C2 = Arduino-rcl:C: SMD Capacitor; CODE-ARDUINO: 0133; DATASHEET: http://search.murata.co.jp/Ceramy/image/img/A01X/partnumbering_e_01.pdf; DISTRIBUTOR-LINK: http://www.digikey.com/product-detail/en/murata-electronics-north-america/GRM155R61E105KA12D/490-10017-1-ND/5026367; DISTRIBUTOR-PN: 490-10017-1-ND; MANUFACTURER: Murata; MANUFACTURER-PN: GRM155R61E105KA12D; NOTE: -
FRAME1 = Arduino-utility:A4L-LOC; CODE-ARDUINO: DNP; DATASHEET: DNP; DISTRIBUTOR-LINK: DNP; DISTRIBUTOR-PN: DNP; MANUFACTURER: DNP; MANUFACTURER-PN: DNP; NOTE: DNP
U1-U4 = Arduino-ICs:SN74LVC1T45: SINGLE-BIT DUAL-SUPPLY BUS TRANSCEIVER WITH CONFIGURABLE VOLTAGE TRANSLATION AND 3-STATE OUTPUTS DIR = L B to A DIR = H (VVCA) A to B; CODE-ARDUINO: A5331; DATASHEET: http://www.ti.com/lit/ds/symlink/sn74lvc1t45-ep.pdf; DISTRIBUTOR-LINK: https://www.digikey.com/product-detail/en/texas-instruments/SN74LVC1T45DCKR/296-16844-1-ND/639460; DISTRIBUTOR-PN: 296-16844-1-ND; MANUFACTURER: TI; MANUFACTURER-PN: SN74LVC1T45DCKR; NOTE: NO

## Net classes
0 default: width 0.19 mm, drill 0.19 mm
1 usb: width 0.19 mm, drill 0.19 mm, clearance 0.127 mm